# EAGLE design ALPS_RSA0N11M9A0J_Faderboard (EAGLE 6.5.0)
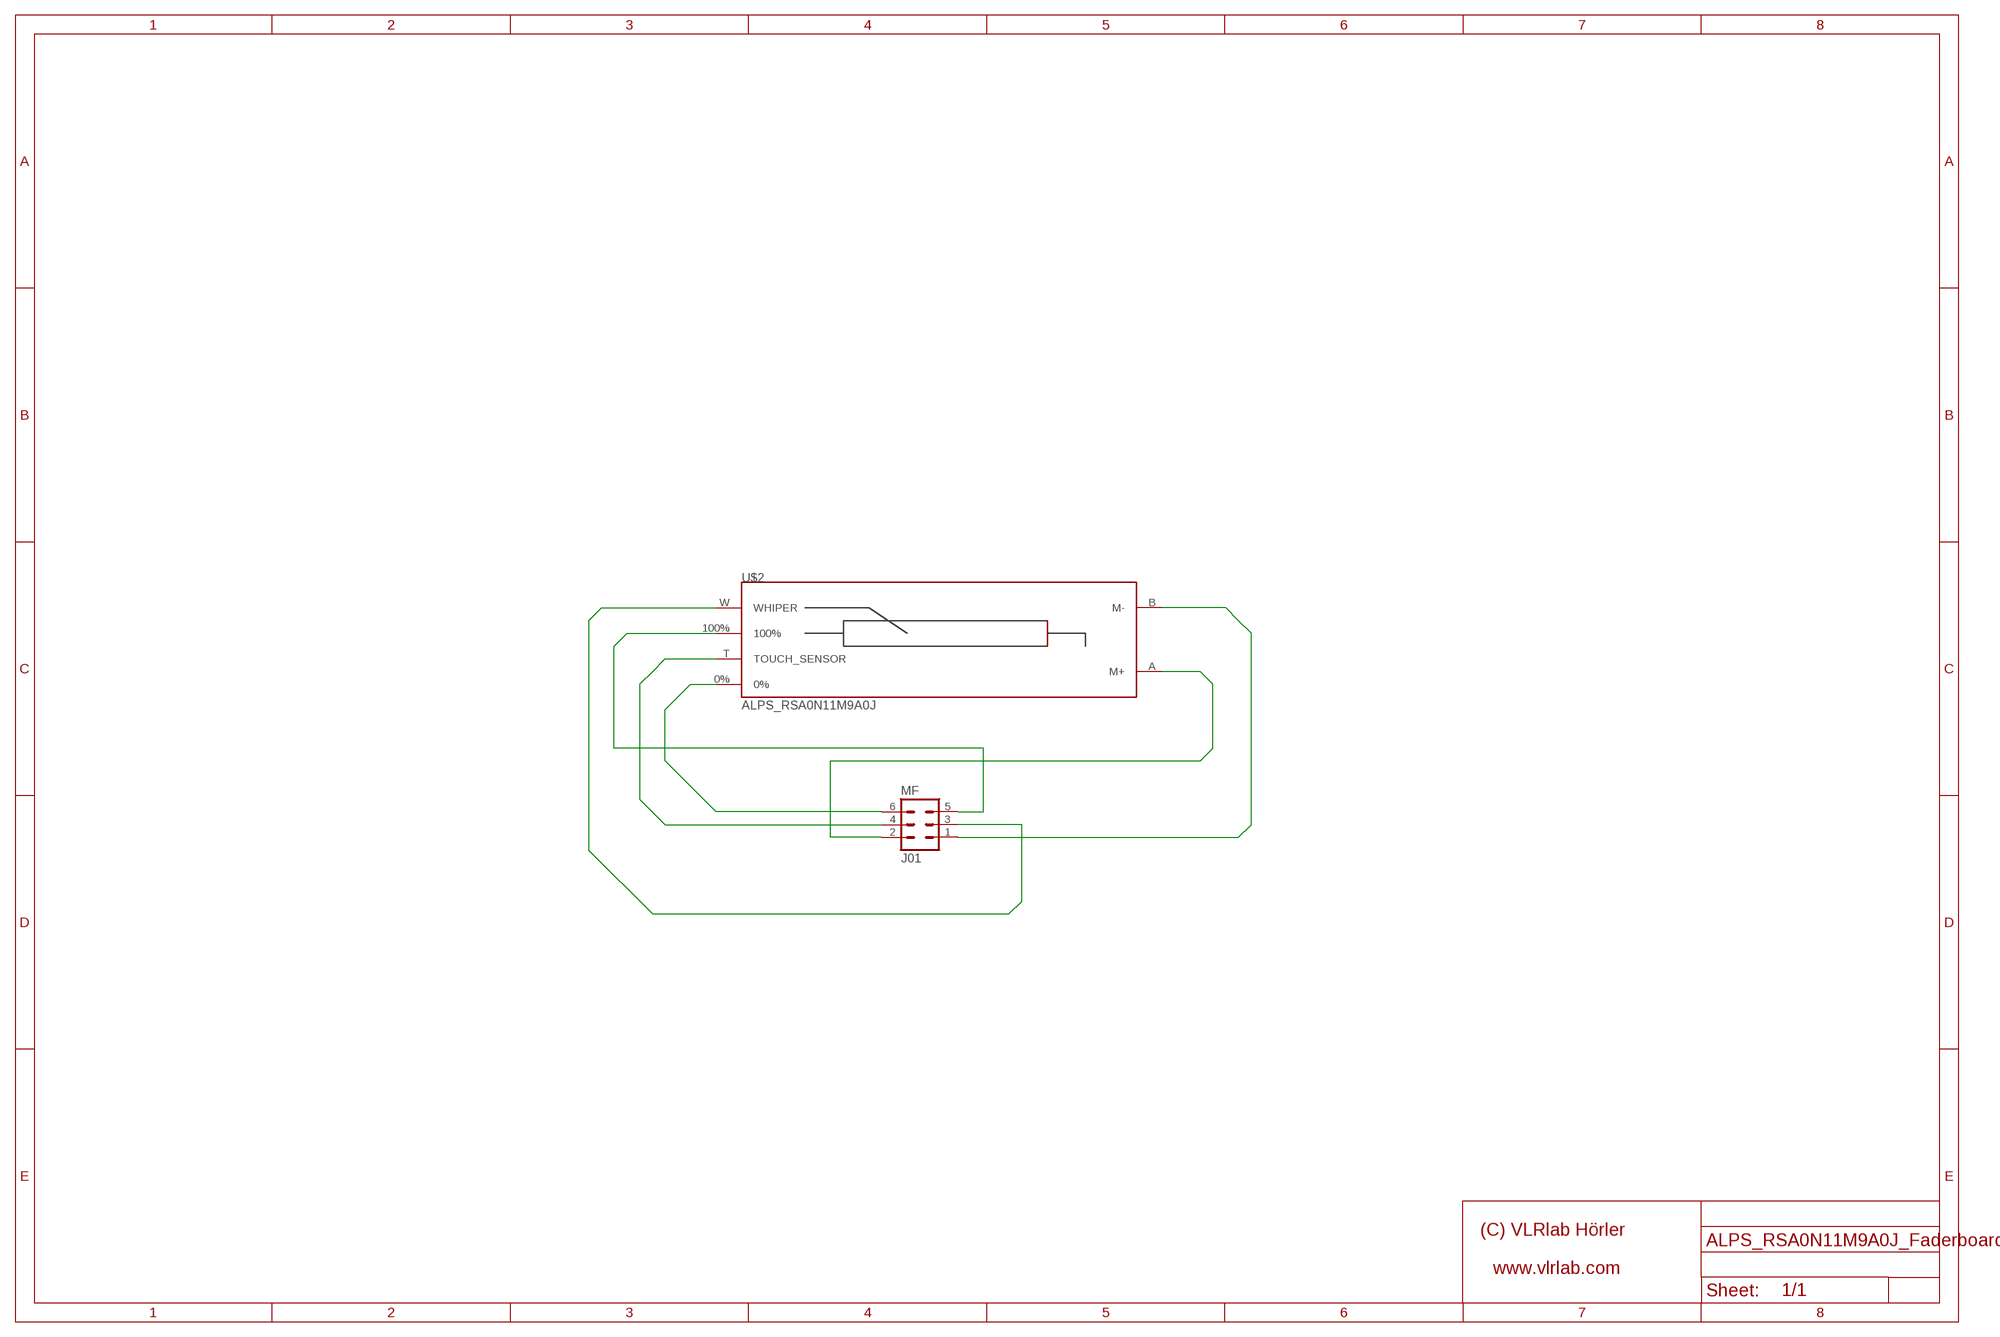
[diagram p0: schematic, sheet 1]

## Parts
MF  J01  ML6  [ML6]
U$2  ALPS_RSA0N11M9A0J  [ALPS_RAS011M9A0J]

## Nets
N$1: MF.6 U$2.0%
N$2: MF.2 U$2.A(M+)
N$3: MF.3 U$2.W(WHIPER)
N$4: MF.1 U$2.B(M-)
N$6: MF.4 U$2.T(TOUCH_SENSOR)
N$9: MF.5 U$2.100%

## Library data of the parts
MF = con-ml:ML6: HARTING; OC_FARNELL: unknown; OC_NEWARK: unknown
U$2 = ALPS_RAS0N11M9A04 on Botom Layer:ALPS_RSA0N11M9A0J

## Board
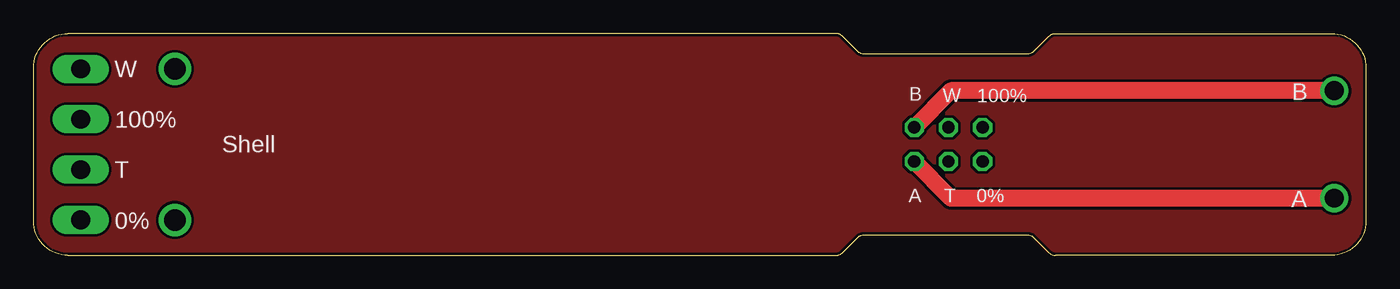
[diagram p1: board, top side]
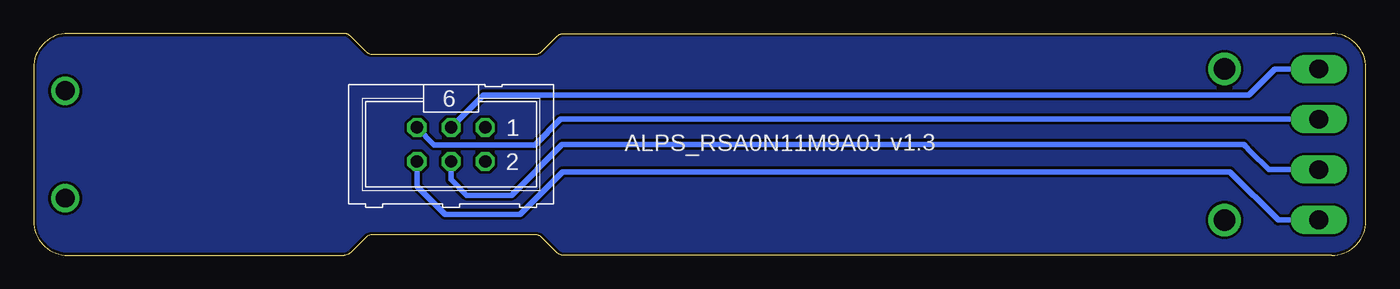
[diagram p2: board, bottom side, seen from below]

Size 99.06 x 16.51 mm. Coordinates in mm from the lower left corner, seen from the top.
Outline: 74.35,1.34 75.51,0.19 arc45 75.95,0 96.52,0 arc90 99.06,2.54 99.06,13.97 arc90 96.52,16.51 75.95,16.51 arc45 75.51,16.32 74.35,15.17 arc-45 73.91,14.99 61.73,14.99 arc-45 61.28,15.17 60.13,16.32 arc45 59.68,16.51 2.54,16.51 arc90 0,13.97 0,2.54 arc90 2.54,0 59.68,0 arc45 60.13,0.19 61.28,1.34 arc-45 61.73,1.52 73.91,1.52 arc-45 74.35,1.34
Copper layers (1*16): Top 0.07mm / dielectric 2mm / Bottom 0.07mm
Design rules "default *": minimum track width 10mil, minimum drill 13mil, track to track 8mil, track to pad 8mil, pad to pad 8mil, via to via 8mil, smd to smd 8mil, copper to edge 8mil, drill to drill 8mil, minimum pad ring 10mil, minimum via ring 8mil, stop-mask expansion 4mil, vias tented up to drill 0mil, thermal gap 0mil

### Footprints (pad centres in the part's own frame; a part is rotated, then mirrored left to right if it is on the bottom)
ML6 = drill 0.914 octagon: 1 -2.54,-1.27; 2 -2.54,1.27; 3 0,-1.27; 4 0,1.27; 5 2.54,-1.27; 6 2.54,1.27
ALPS_RAS011M9A0J = drill 1.4 long: 0% -44.45,-5.625; 100% -44.45,1.875; T -44.45,-1.875; W -44.45,5.625 | drill 1.4: A 48.75,-4; B 48.75,4 | drill 1.6: L1 -37.45,5.625; L2 -37.45,-5.625

### Placement (x,y rotation side)
MF  68.02,8.26 180 bottom
U$1  [VLRLAB]  34.75,6.91 0 top
U$2  47.96,8.26 0 top

### Tracks (layer width: path | path; a pad name or v marks a point on that pad's centre or on a via)
GND
  pour Top: 2.54,0 59.94,0 61.37,1.42 74.17,1.42 75.59,0 96.52,0 arc90 99.06,2.54 99.06,13.97 arc90 96.52,16.51 75.64,16.51 74.17,15.04 61.57,15.04 59.94,16.66 2.54,16.51 arc90 0,13.97 0,2.54 arc90
  pour Bottom: 2.54,0 59.94,0 61.37,1.42 74.17,1.42 75.59,0 96.52,0 arc90 99.06,2.54 99.06,13.97 arc90 96.52,16.51 75.59,16.46 74.17,15.04 61.57,15.04 59.94,16.66 2.54,16.51 arc90 0,13.97 0,2.54 arc90
N$1
  Bottom 0.406: U$2.0% 6.52,2.63 10.11,6.22 59.72,6.22 62.89,3.05 68.48,3.05 70.56,5.13 MF.6
N$2
  Top 1.27: U$2.A 68.21,4.25 MF.2
N$3
  Bottom 0.406: U$2.W 6.77,13.88 8.71,11.94 60.61,11.94 65.61,11.94 MF.3
N$4
  Top 1.27: U$2.B 68.21,12.26 MF.1
N$6
  Bottom 0.406: U$2.T 7.22,6.38 8.59,7.75 8.97,8.13 9.09,8.26 59.75,8.26 63.54,4.47 66.85,4.47 68.02,5.64 MF.4
N$9
  Bottom 0.406: U$2.100% 59.88,10.13 61.78,8.23 69.29,8.23 70.56,9.5 MF.5

### Text on the board
tPlace: B | B | W | 100% | A | T | 0% | A
bPlace: v1.3